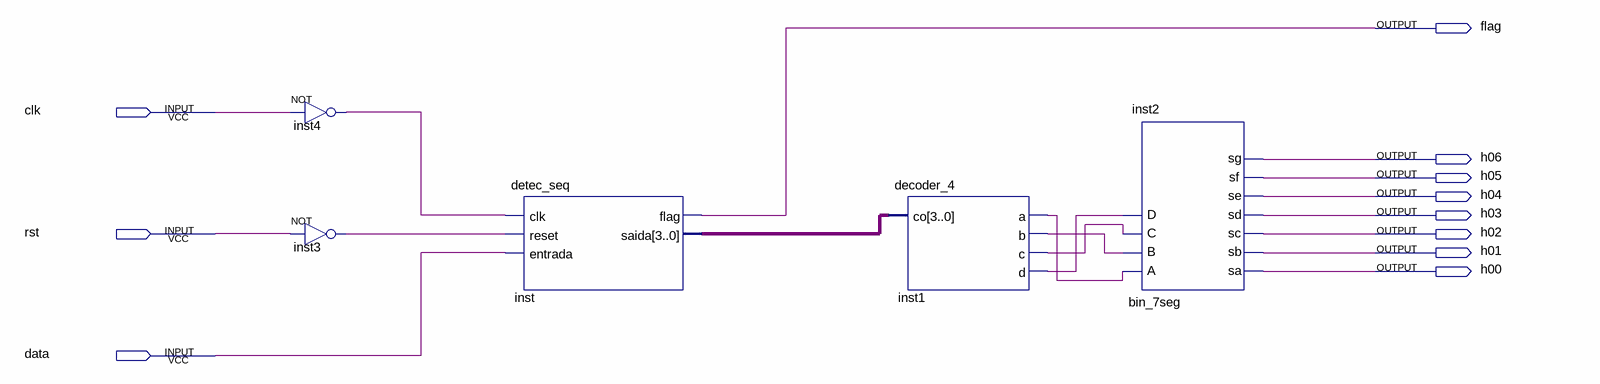
[diagram p0: schematic sheet]
// Quartus schematic lab06.bdf as structural Verilog: 5 symbols, 11 pins
module lab06 (
  input  clk,
  input  rst,
  input  data,
  output flag,
  output h06,
  output h05,
  output h04,
  output h03,
  output h02,
  output h01,
  output h00
);

  wire inst1_a, inst1_b, inst1_c, inst1_d, inst3_out, inst4_out;
  wire [3:0] inst_saida;

  not inst4 (inst4_out, clk);
  not inst3 (inst3_out, rst);
  detec_seq inst (.clk(inst4_out), .reset(inst3_out), .entrada(data), .flag(flag), .saida(inst_saida));
  decoder_4 inst1 (.co(inst_saida), .a(inst1_a), .b(inst1_b), .c(inst1_c), .d(inst1_d));
  bin_7seg inst2 (
    .A(inst1_a), .B(inst1_b), .C(inst1_c), .D(inst1_d), .sa(h00), .sb(h01), .sc(h02), .sd(h03), .se(h04),
    .sf(h05), .sg(h06));
endmodule
